# EAGLE design SwitchBoard_1.1 (EAGLE 6.5.0)
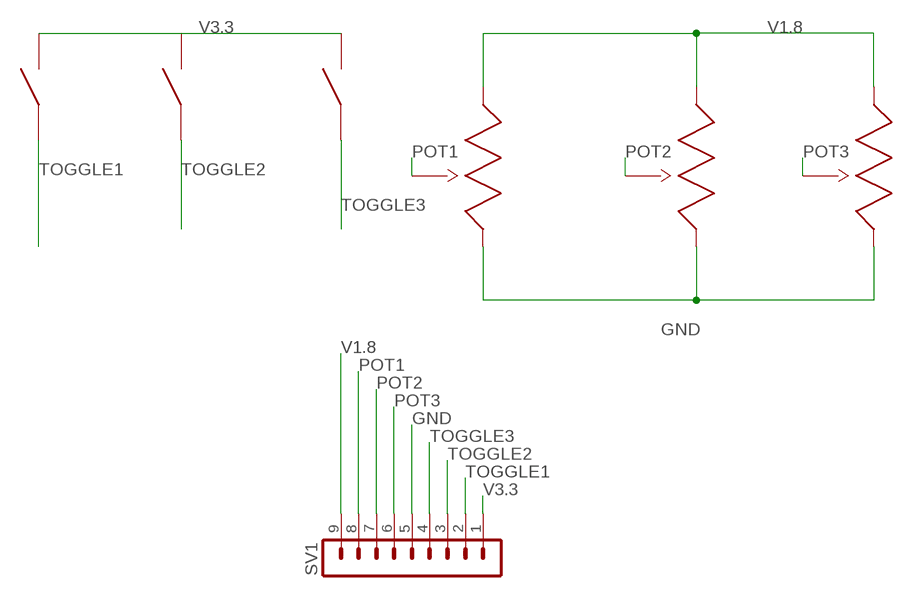
[diagram p0: schematic, sheet 1]

## Parts
POT1  PRS11S-11  [POT-SMD]
POT2  PRS11S-11  [POT-SMD]
POT3  PRS11S-11  [POT-SMD]
SV1  MA09-1  [MA09-1]
TOGGLE1  COM-09276  [SPST-TOGGLE-SWITCH]
TOGGLE2  COM-09276  [SPST-TOGGLE-SWITCH]
TOGGLE3  COM-09276  [SPST-TOGGLE-SWITCH]

## Nets
GND: POT1.1 POT2.1 POT3.1 SV1.5
POT1: POT1.2 SV1.8
POT2: POT2.2 SV1.7
POT3: POT3.2 SV1.6
TOGGLE1: SV1.2 TOGGLE1.1
TOGGLE2: SV1.3 TOGGLE2.1
TOGGLE3: SV1.4 TOGGLE3.1
V1.8: POT1.3 POT2.3 POT3.3 SV1.9
V3.3: SV1.1 TOGGLE1.2 TOGGLE2.2 TOGGLE3.2

## Library data of the parts
POT1-POT3 = PhysicalSwitches:PRS11S-11: SMD Potentiometer Digi-Key: PRS11S-N20F-503B1-ND
SV1 = con-lstb:MA09-1: PIN HEADER; OC_FARNELL: unknown; OC_NEWARK: unknown
TOGGLE1-TOGGLE3 = PhysicalSwitches:COM-09276: SPST Single Pole Single Throw Toggle Switch SparkFun: COM-09276

## Board
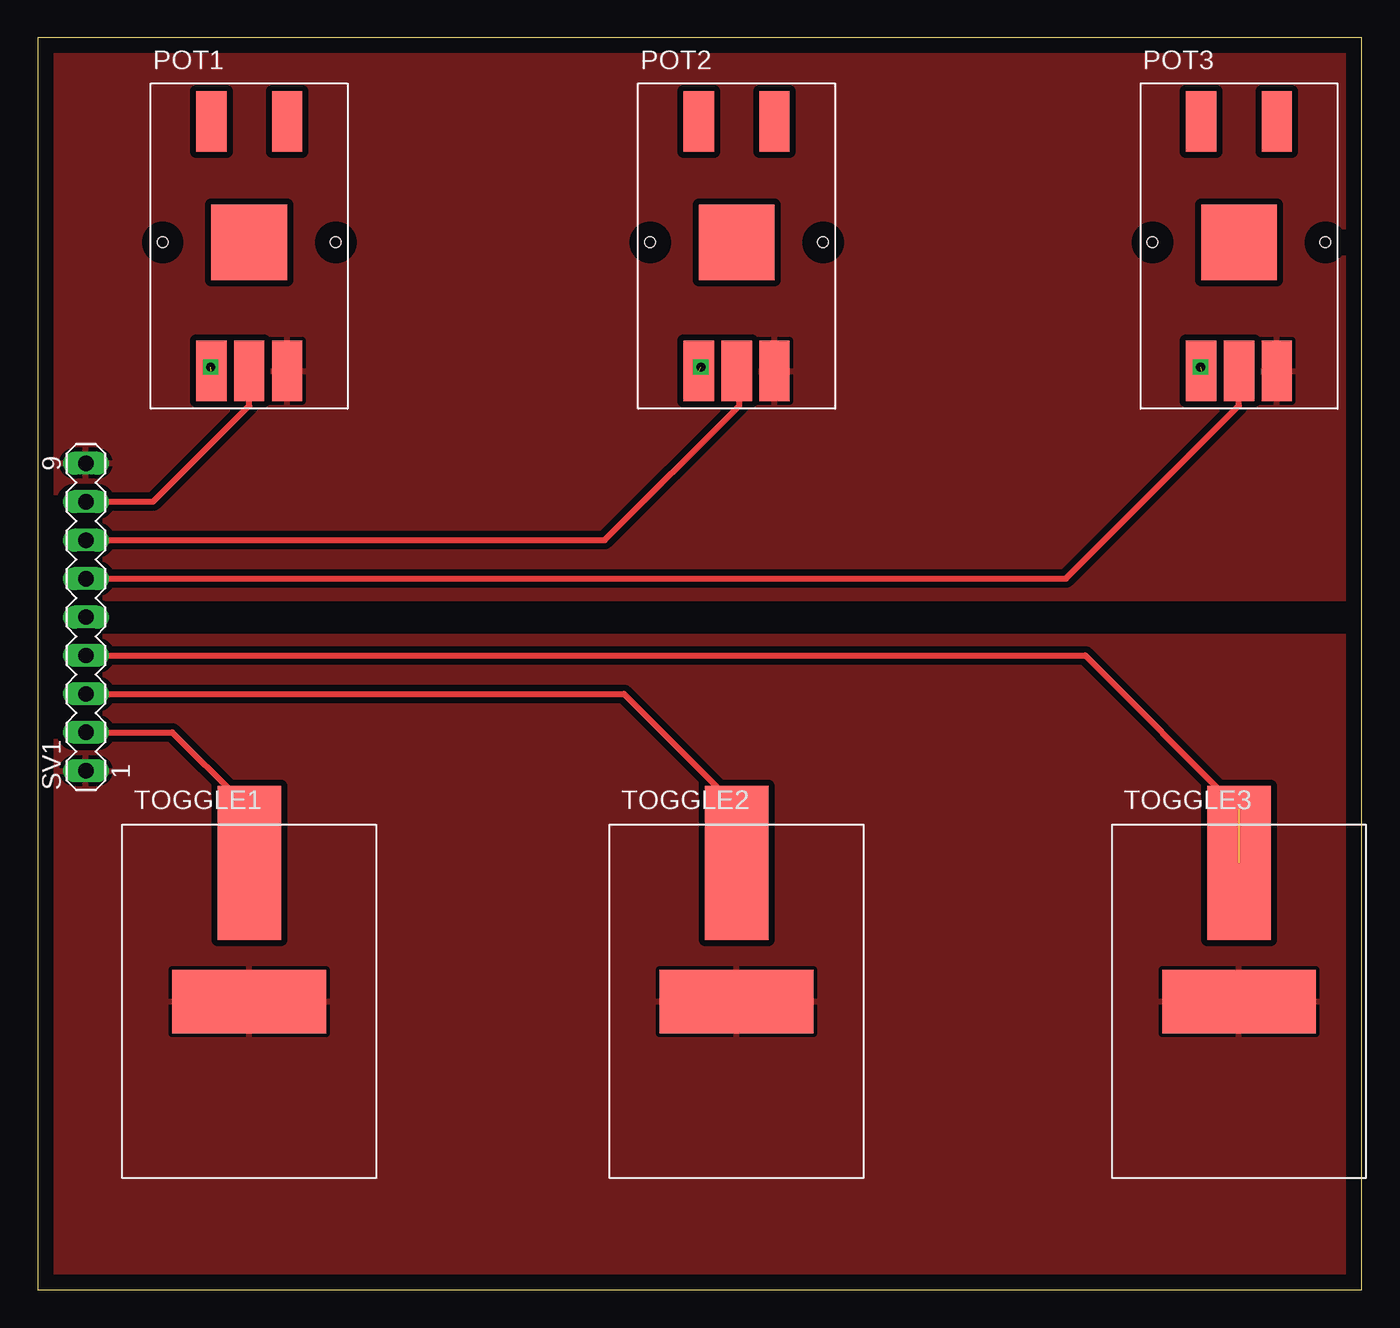
[diagram p1: board, top side]
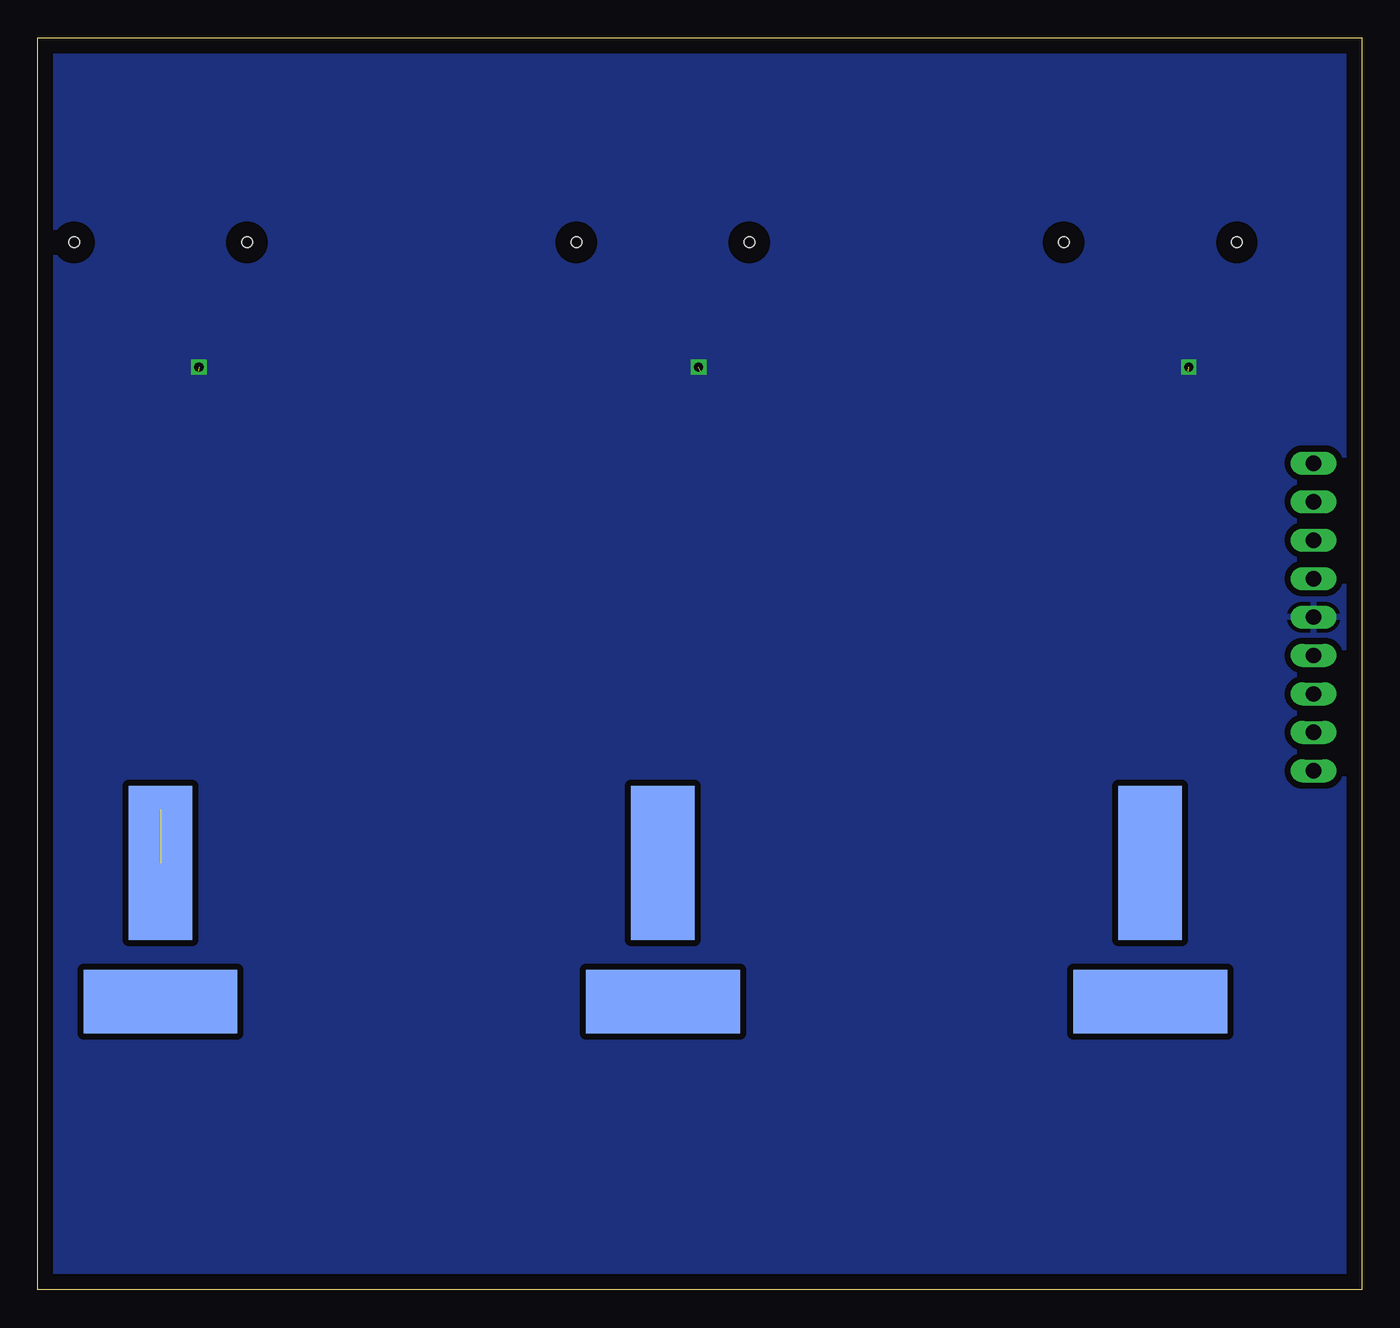
[diagram p2: board, bottom side, seen from below]

Size 87.48 x 82.73 mm. Coordinates in mm from the lower left corner, seen from the top.
Outline: 0,0 87.48,0 87.48,82.73 0,82.73 0,0
Copper layers (1*16): Top 0.035mm / dielectric 1.5mm / Bottom 0.035mm
Design rules "default": minimum track width 10mil, minimum drill 24mil, track to track 8mil, track to pad 8mil, pad to pad 8mil, via to via 8mil, smd to smd 8mil, copper to edge 40mil, drill to drill 8mil, minimum pad ring 10mil, minimum via ring 8mil, stop-mask expansion 4mil, vias tented up to drill 0mil, thermal gap 10mil

### Footprints (pad centres in the part's own frame; a part is rotated, then mirrored left to right if it is on the bottom)
POT-SMD = smd 2 x 4: 1 -2.5,-8.5; 2 0,-8.5; 3 2.5,-8.5; NOCONN1 -2.5,8; NOCONN2 2.5,8 | smd 5 x 5: GLUEPAD 0,0 | hole 0.7: -5.715,0; 5.715,0
MA09-1 = drill 1.016 long: 1 -10.16,0; 2 -7.62,0; 3 -5.08,0; 4 -2.54,0; 5 0,0; 6 2.54,0; 7 5.08,0; 8 7.62,0; 9 10.16,0
SPST-TOGGLE-SWITCH = smd 4.191 x 10.16: 1 0,9.144 | smd 10.16 x 4.191: 2 0,0 | smd 4.191 x 10.16 bottom: 3 0,9.144 | smd 10.16 x 4.191 bottom: 4 0,0

### Placement (x,y rotation side)
POT1  13.97,69.22 0 top
POT2  46.18,69.22 0 top
POT3  79.38,69.22 0 top
SV1  3.17,44.45 90 top
TOGGLE1  13.97,19.05 0 top
TOGGLE2  46.18,19.05 0 top
TOGGLE3  79.38,19.05 0 top

### Tracks (layer width: path | path; a pad name or v marks a point on that pad's centre or on a via)
GND  (via drill 0.6)  (3 unrouted)
  other vias: 11.43,60.96 43.81,60.96 76.83,60.96
  pour Bottom (isolate 0.406): 0,82.55 87.63,82.55 87.63,0 0,0
POT1
  Top 0.406: SV1.8 7.62,52.07 13.97,58.42 POT1.2
POT2
  Top 0.406: SV1.7 37.47,49.53 46.35,58.42 46.35,60.54 POT2.2
POT3
  Top 0.406: SV1.6 67.94,46.99 79.38,58.42 POT3.2
TOGGLE1
  Top 0.406: SV1.2 8.89,36.83 13.34,32.38 13.97,31.75 | 13.97,31.75 14.61,31.11 | TOGGLE1.1 13.97,31.75
TOGGLE2
  Top 0.406: SV1.3 38.73,39.37 46.35,31.75 46.18,31.57 TOGGLE2.1
TOGGLE3  (1 unrouted)
  Top 0.406: SV1.4 69.22,41.91 79.38,31.75
V1.8
  pour Top (isolate 0.406): 0,82.55 0,45.72 87.63,45.72 87.63,82.55
V3.3
  pour Top (isolate 0.406): 0,43.18 87.63,43.18 87.63,0 0,0